# Altium schematic sheet [SCH]_MainProcessor.SchDoc
size A
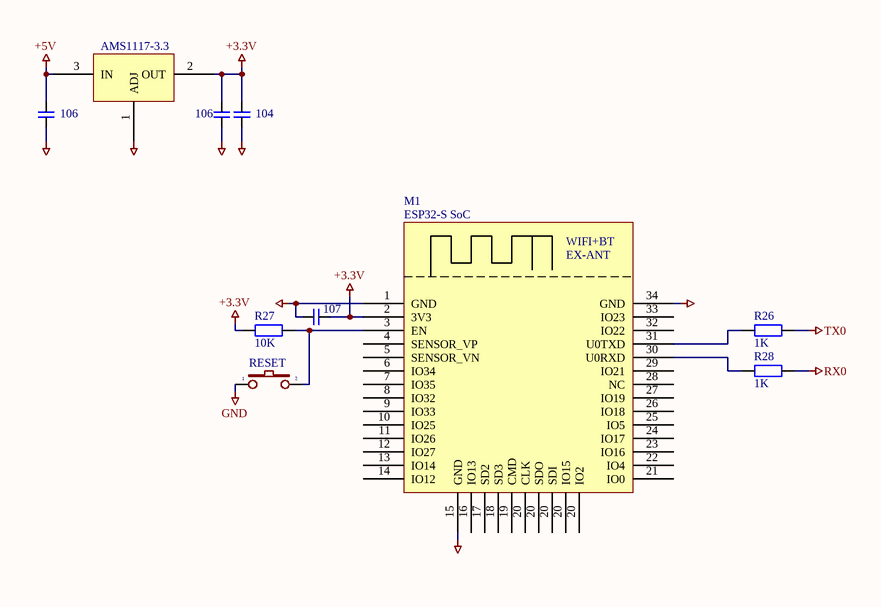
[diagram p0: [SCH]_MainProcessor.SchDoc]

## Parts
C13  106  [CAP-SMD-01005]
C14  106  [CAP-SMD-01005]
C15  104  [CAP-SMD-01005]
C16  107  [CAP-SMD-01005]
IC4  AMS1117-3.3  [SOT223(123)]
K1  RESET  [Button-SMD2/3x6]
M1  ESP32-S SoC  [ESP32-S-Footprint]
R26  1K  [RES-SMD-0805]
R27  10K  [RES-SMD-0805]
R28  1K  [RES-SMD-0805]

## Nets
+3.3V: C14.2 C15.2 C16.2 IC4.2(OUT) M1.2(3V3) R27.2
+5V: C13.2 IC4.3(IN)
GND: C13.1 C14.1 C15.1 C16.1 IC4.1(ADJ) K1.1 M1.1(GND) M1.15(GND) M1.34(GND)
RX0: R28.1
TX0: R26.1
NetK1_2: K1.2 M1.3(EN) R27.1
NetM1_30: M1.30(U0RXD) R28.2
NetM1_31: M1.31(U0TXD) R26.2

Not connected (* = marked no-connect by the designer): M1 4(SENSOR_VP) 5(SENSOR_VN) 6(IO34) 7(IO35) 8(IO32) 9(IO33) 10(IO25) 11(IO26) 12(IO27) 13(IO14) 14(IO12) 16(IO13) 17(SD2) 18(SD3) 19(CMD) 20(CLK) 21(IO0) 22(IO4) 23(IO16) 24(IO17) 25(IO5) 26(IO18) 27(IO19) 28(NC) 29(IO21) 32(IO22) 33(IO23)

## Notes on the sheet
- (in symbol ESP32-S WIFI_BT_SoC) WIFI+BT; EX-ANT

## Library data of the parts
C13-C16 = Cap-Non-SMD: Non-polar capacitor
IC4 = AMS1117
K1 = Button-2: Switch button 2 pin; Value: SW chip 2 pin
M1 = ESP32-S WIFI_BT_SoC: ComponentLink1Description: PCB; ComponentLink1URL: https://evertdekker.com/wp/?p=854
R26-R28 = Res SMD: Resistor SMD